# Altium schematic sheet main.SchDoc
size A4
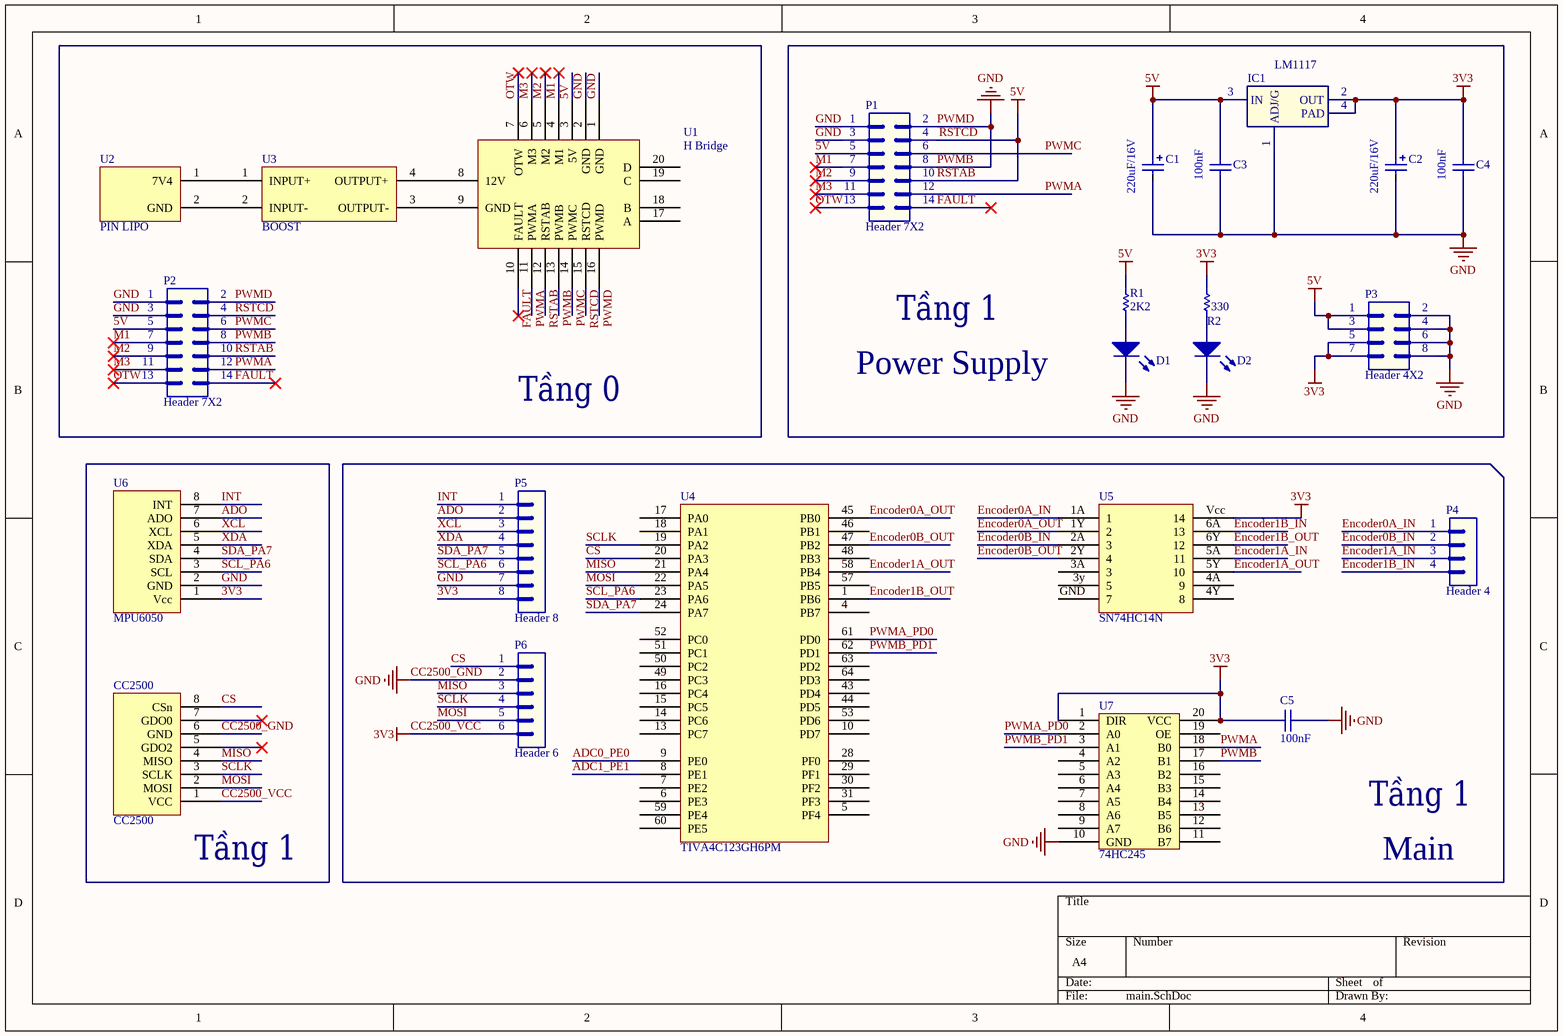
[diagram p0: main.SchDoc]

## Parts
C1  value 220uF/16V  [CP1/2]  (hidden comment: Cap Pol)
C2  value 220uF/16V  [CP1/2]  (hidden comment: Cap Pol)
C3  value 100nF  [CN1]  (hidden comment: Cap Non-Pol)
C4  value 100nF  [CN1]  (hidden comment: Cap Non-Pol)
C5  value 100nF  [CN1]  (hidden comment: Cap Non-Pol)
CC2500  CC2500
D1  LED  [LED-5mm]  (value not drawn)
D2  LED  [LED-5mm]  (value not drawn)
IC1  LM1117  [SOT223-4N]
P1  Header 7X2  [JP7X2]
P2  Header 7X2  [JP7X2]
P3  Header 4X2  [JP4x2]
P4  Header 4  [JP4]
P5  Header 8  [JP8]
P6  Header 6  [JP6]
R1  value 2K2  [RES 1/2W]  (hidden comment: Resistor 1/4W)
R2  value 330  [RES 1/2W]  (hidden comment: Resistor 1/4W)
U1  H Bridge
U2  PIN LIPO
U3  BOOST
U4  TIVA4C123GH6PM
U5  SN74HC14N
U6  MPU6050
U7  74HC245  [DIP20/W0.3]

## Nets
3V3: C2.1 C4.2 C5.1 CC2500.1(VCC) IC1.2(OUT) IC1.4(PAD) P3.5 P3.7 P5.8 P6.6 R2.2 U5.Vcc(14) U6.1(Vcc) U7.1(DIR) U7.20(VCC)  [also labelled CC2500_VCC]
5V: C1.1 C3.2 IC1.3(IN) P1.4 P1.5 P1.10 P2.4 P2.5 P2.10 P3.1 P3.3 R1.2 U1.3(5V) U1.12(RSTAB) U1.15(RSTCD)  [also labelled RSTAB, RSTCD]
CC2500_GND: C1.2 C2.2 C3.1 C4.1 C5.2 CC2500.6(GND) D1.2(K) D2.2(K) IC1.1(ADJ/G) P1.1 P1.2 P1.3 P1.8 P2.1 P2.2 P2.3 P2.8 P3.2 P3.4 P3.6 P3.8 P5.7 P6.2 U1.1(GND) U1.2(GND) U1.13(PWMB) U1.16(PWMD) U6.2(GND) U7.10(GND) U7.17(B1)  [also labelled GND, PWMB, PWMD]
ADC0_PE0: U4.9(PE0)
ADC1_PE1: U4.8(PE1)
ADO: P5.2 U6.7(ADO)
CS: CC2500.8(CSn) P6.1 U4.20(PA3)
Encoder0A_IN: P4.1 U5.1A(1)
Encoder0A_OUT: U4.45(PB0) U5.1Y(2)
Encoder0B_IN: P4.2 U5.2A(3)
Encoder0B_OUT: U4.47(PB2) U5.2Y(4)
Encoder1A_IN: P4.3 U5.5A(11)
Encoder1A_OUT: U4.58(PB4) U5.5Y(10)
Encoder1B_IN: P4.4 U5.6A(13)
Encoder1B_OUT: U4.1(PB6) U5.6Y(12)
FAULT: P1.14 P2.14 U1.10(FAULT)
INT: P5.1 U6.8(INT)
M1: P1.7 P2.7 U1.4(M1)
M2: P1.9 P2.9 U1.5(M2)
M3: P1.11 P2.11 U1.6(M3)
MISO: CC2500.4(MISO) P6.3 U4.21(PA4)
MOSI: CC2500.2(MOSI) P6.5 U4.22(PA5)
OTW: P1.13 P2.13 U1.7(OTW)
PWMA: P1.12 P2.12 U1.11(PWMA) U7.18(B0)
PWMA_PD0: U4.61(PD0) U7.2(A0)
PWMB_PD1: U4.62(PD1) U7.3(A1)
PWMC: P1.6 P2.6 U1.14(PWMC)
SCL_PA6: P5.6 U4.23(PA6) U6.3(SCL)
SCLK: CC2500.3(SCLK) P6.4 U4.19(PA2)
SDA_PA7: P5.5 U4.24(PA7) U6.4(SDA)
XCL: P5.3 U6.6(XCL)
XDA: P5.4 U6.5(XDA)
NetD1_1: D1.1(A) R1.1
NetD2_1: D2.1(A) R2.1
NetU1_8: U1.8(12V) U3.4(OUTPUT+)
NetU1_9: U1.9(GND) U3.3(OUTPUT-)
NetU2_1: U2.1(7V4) U3.1(INPUT+)
NetU2_2: U2.2(GND) U3.2(INPUT-)

Not connected (* = marked no-connect by the designer): CC2500 5(GDO2)* 7(GDO0)*; U1 17(A) 18(B) 19(C) 20(D); U4 4(PB7) 5(PF4) 6(PE3) 7(PE2) 10(PD7) 13(PC7) 14(PC6) 15(PC5) 16(PC4) 17(PA0) 18(PA1) 28(PF0) 29(PF1) 30(PF2) 31(PF3) 43(PD4) 44(PD5) 46(PB1) 48(PB3) 49(PC3) 50(PC2) 51(PC1) 52(PC0) 53(PD6) 57(PB5) 59(PE4) 60(PE5) 63(PD2) 64(PD3); U5 3A(3) 3y(5) 4A(9) 4Y(8) GND(7); U7 4(A2) 5(A3) 6(A4) 7(A5) 8(A6) 9(A7) 11(B7) 12(B6) 13(B5) 14(B4) 15(B3) 16(B2) 19(OE)

## Notes on the sheet
- Power Supply
- Tầng 1
- Tầng 0
- (near CC2500) Tầng 1
- Main

## Library data of the parts
C1 C2 = Cap Pol: Polarized Capacitor (Radial)
C3-C5 = Cap Non-Pol: Capacitor
IC1 = LM1117: Available in 1.8V, 2.5V, 2.85V, 3.3V, 5V, and  Adjustable Versions; Value: LM317
P1 P2 = Header 7X2: Header, 7-Pin, Dual row; LatestRevisionDate: 17-Jul-2002; LatestRevisionNote: Re-released for DXP Platform.; Publisher: Altium Limited
P3 = Header 4X2: Header, 4-Pin, Dual row; LatestRevisionDate: 17-Jul-2002; LatestRevisionNote: Re-released for DXP Platform.; Publisher: Altium Limited
P4 = Header 4: Header, 4-Pin; LatestRevisionDate: 17-Jul-2002; LatestRevisionNote: Re-released for DXP Platform.; Publisher: Altium Limited
P5 = Header 8: Header, 8-Pin; LatestRevisionDate: 17-Jul-2002; LatestRevisionNote: Re-released for DXP Platform.; Publisher: Altium Limited
P6 = Header 6: Header, 6-Pin; LatestRevisionDate: 17-Jul-2002; LatestRevisionNote: Re-released for DXP Platform.; Publisher: Altium Limited
R1 R2 = RES
U7 = 74HC245: Octal bus tranceiver